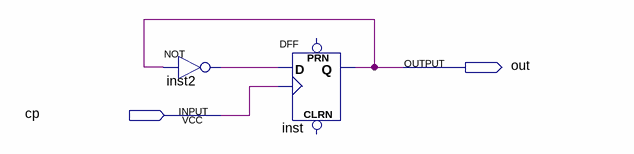
[diagram p0: schematic sheet]
// Quartus schematic FF.bdf as structural Verilog: 2 symbols, 2 pins
module FF (
  input  cp,
  output out
);

  wire inst2_out;

  not inst2 (inst2_out, out);
  DFF inst (.CLK(cp), .D(inst2_out), .Q(out));  // open: CLRN, PRN
endmodule
